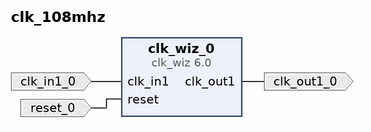
[diagram p0: block diagram of the top level]
# Vivado block design clk_108mhz, xc7a35tcpg236-1, Vivado 2021.1
create_bd_design clk_108mhz

create_bd_port -dir I -type clk clk_in1_0
create_bd_port -dir O -type clk clk_out1_0
set_property -dict {CONFIG.FREQ_HZ 108000000} [get_bd_ports clk_out1_0]
create_bd_port -dir I -type rst reset_0
set_property -dict {CONFIG.POLARITY ACTIVE_HIGH} [get_bd_ports reset_0]

create_bd_cell -type ip -vlnv xilinx.com:ip:clk_wiz:6.0 clk_wiz_0
set_property -dict [list \
  CONFIG.CLKOUT1_DRIVES BUFG \
  CONFIG.CLKOUT1_JITTER 127.691 \
  CONFIG.CLKOUT1_PHASE_ERROR 97.646 \
  CONFIG.CLKOUT1_REQUESTED_OUT_FREQ 108 \
  CONFIG.CLKOUT2_DRIVES BUFG \
  CONFIG.CLKOUT3_DRIVES BUFG \
  CONFIG.CLKOUT4_DRIVES BUFG \
  CONFIG.CLKOUT5_DRIVES BUFG \
  CONFIG.CLKOUT6_DRIVES BUFG \
  CONFIG.CLKOUT7_DRIVES BUFG \
  CONFIG.ENABLE_CLOCK_MONITOR false \
  CONFIG.FEEDBACK_SOURCE FDBK_AUTO \
  CONFIG.MMCM_BANDWIDTH OPTIMIZED \
  CONFIG.MMCM_CLKFBOUT_MULT_F 10.125 \
  CONFIG.MMCM_CLKOUT0_DIVIDE_F 9.375 \
  CONFIG.MMCM_COMPENSATION ZHOLD \
  CONFIG.MMCM_DIVCLK_DIVIDE 1 \
  CONFIG.PRIMITIVE MMCM \
  CONFIG.PRIM_IN_FREQ 100.000 \
  CONFIG.RESET_PORT reset \
  CONFIG.RESET_TYPE ACTIVE_HIGH \
  CONFIG.USE_LOCKED false \
] [get_bd_cells clk_wiz_0]

# ---- connections ----

connect_bd_net -net clk_in1_0_1 [get_bd_ports clk_in1_0] [get_bd_pins clk_wiz_0/clk_in1]
connect_bd_net [get_bd_pins clk_wiz_0/clk_out1] [get_bd_ports clk_out1_0]
connect_bd_net -net reset_0_1 [get_bd_ports reset_0] [get_bd_pins clk_wiz_0/reset]

validate_bd_design
save_bd_design
